# Altium schematic sheet US_SB_Meteo.SchDoc
size A4
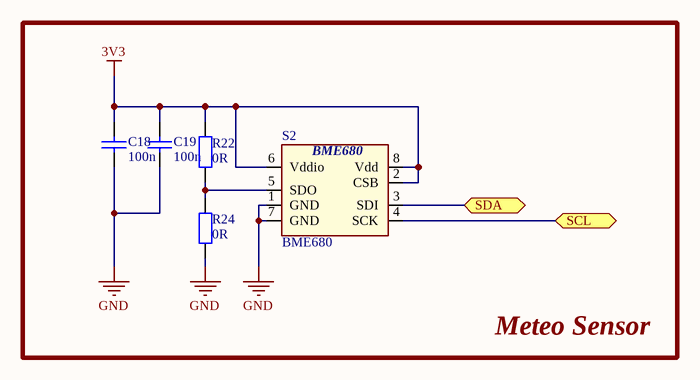
[diagram p0: US_SB_Meteo.SchDoc]

## Parts
C18  100n  [C0603_IPC_HD]
C19  100n  [C0603_IPC_HD]
R22  0R  [R0603_IPC_MD]  (no BOM)
R24  0R  [R0603_IPC_MD]
S2  BME680  [BME680]

## Blocks framed on the sheet
Meteo Sensor: C18 C19 R22 R24 S2

## Ports
SCL, SDA

## Nets
3V3: C18.2 C19.2 R22.2 S2.2(CSB) S2.6(Vddio) S2.8(Vdd)
GND: C18.1 C19.1 R24.1 S2.1(GND) S2.7(GND)
SCL: S2.4(SCK) ; port SCL
SDA: S2.3(SDI) ; port SDA
NetR22_1: R22.1 R24.2 S2.5(SDO)

## Library data of the parts
C18 C19 = CL10B104KO8NNNC: CAP CER 0.1UF 16V X7R 0603; Manufacturer: Samsung Electro-Mechanics; Manufacturer Part Number: CL10B104KO8NNNC; Voltage: 16V; Value: 100n; Dielectric: X7R; Supplier 1: Digi-Key; Supplier Part Number 1: 1276-1005-1-ND
R22 R24 = CR0603-J/-000ELF: RES SMD 0 OHM JUMPER 1/10W 0603; Manufacturer: Bourns Inc.; Tolarance: 1%; Value: 0R; Manufacturer Part Number: CR0603-J/-000ELF; Supplier 1: Digi-Key; Supplier Part Number 1: CR0603-J/-000ELFCT-ND
S2 = BME680: Gas, Humidity, Pressure, Temperature Sensor I²C, SPI Output; Manufacturer: Bosch Sensortec; Manufacturer Part Number: BME680; Supplier 1: Digi-Key; Supplier Part Number 1: 828-1077-1-ND